# EAGLE design wykonawczy (EAGLE 6.4)
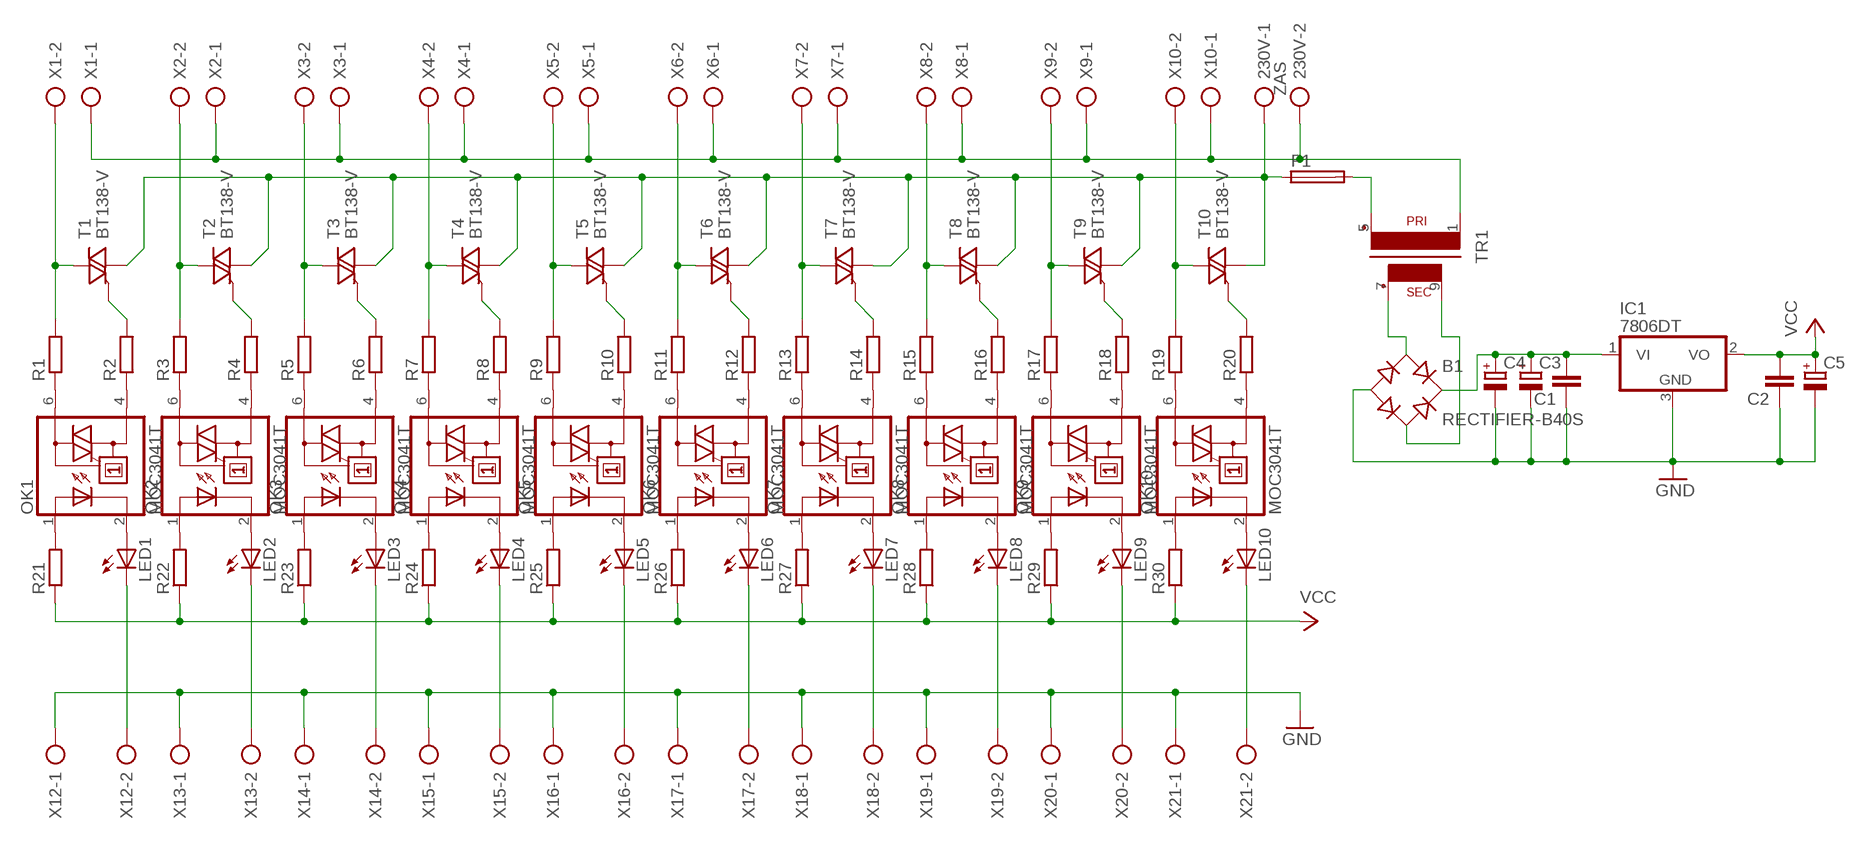
[diagram p0: schematic, sheet 1]

## Parts
230V  ZAS  AK500/2  [AK500/2]
B1  RECTIFIER-B40S  [B40S]
C1  C-EU025-025X050  [C025-025X050]
C2  C-EU025-025X050  [C025-025X050]
C3  CPOL-EUE2.5-6  [E2,5-6]
C4  CPOL-EUE2.5-6  [E2,5-6]
C5  CPOL-EUE2.5-6  [E2,5-6]
F1  19560  [19560]
IC1  7806DT  [TO252]
LED1  LED5MM  [LED5MM]
LED2  LED5MM  [LED5MM]
LED3  LED5MM  [LED5MM]
LED4  LED5MM  [LED5MM]
LED5  LED5MM  [LED5MM]
LED6  LED5MM  [LED5MM]
LED7  LED5MM  [LED5MM]
LED8  LED5MM  [LED5MM]
LED9  LED5MM  [LED5MM]
LED10  LED5MM  [LED5MM]
OK1  MOC3041T  [DIL06B]
OK2  MOC3041T  [DIL06B]
OK3  MOC3041T  [DIL06B]
OK4  MOC3041T  [DIL06B]
OK5  MOC3041T  [DIL06B]
OK6  MOC3041T  [DIL06B]
OK7  MOC3041T  [DIL06B]
OK8  MOC3041T  [DIL06B]
OK9  MOC3041T  [DIL06B]
OK10  MOC3041T  [DIL06B]
R1  R-EU_0204/7  [0204/7]
R2  R-EU_0204/7  [0204/7]
R3  R-EU_0204/7  [0204/7]
R4  R-EU_0204/7  [0204/7]
R5  R-EU_0204/7  [0204/7]
R6  R-EU_0204/7  [0204/7]
R7  R-EU_0204/7  [0204/7]
R8  R-EU_0204/7  [0204/7]
R9  R-EU_0204/7  [0204/7]
R10  R-EU_0204/7  [0204/7]
R11  R-EU_0204/7  [0204/7]
R12  R-EU_0204/7  [0204/7]
R13  R-EU_0204/7  [0204/7]
R14  R-EU_0204/7  [0204/7]
R15  R-EU_0204/7  [0204/7]
R16  R-EU_0204/7  [0204/7]
R17  R-EU_0204/7  [0204/7]
R18  R-EU_0204/7  [0204/7]
R19  R-EU_0204/7  [0204/7]
R20  R-EU_0204/7  [0204/7]
R21  R-EU_0204/7  [0204/7]
R22  R-EU_0204/7  [0204/7]
R23  R-EU_0204/7  [0204/7]
R24  R-EU_0204/7  [0204/7]
R25  R-EU_0204/7  [0204/7]
R26  R-EU_0204/7  [0204/7]
R27  R-EU_0204/7  [0204/7]
R28  R-EU_0204/7  [0204/7]
R29  R-EU_0204/7  [0204/7]
R30  R-EU_0204/7  [0204/7]
T1  BT138-V  [TO220BV]
T2  BT138-V  [TO220BV]
T3  BT138-V  [TO220BV]
T4  BT138-V  [TO220BV]
T5  BT138-V  [TO220BV]
T6  BT138-V  [TO220BV]
T7  BT138-V  [TO220BV]
T8  BT138-V  [TO220BV]
T9  BT138-V  [TO220BV]
T10  BT138-V  [TO220BV]
TR1  EI30-1  [EI30-1]
X1  AK500/2  [AK500/2]
X2  AK500/2  [AK500/2]
X3  AK500/2  [AK500/2]
X4  AK500/2  [AK500/2]
X5  AK500/2  [AK500/2]
X6  AK500/2  [AK500/2]
X7  AK500/2  [AK500/2]
X8  AK500/2  [AK500/2]
X9  AK500/2  [AK500/2]
X10  AK500/2  [AK500/2]
X12  AK500/2  [AK500/2]
X13  AK500/2  [AK500/2]
X14  AK500/2  [AK500/2]
X15  AK500/2  [AK500/2]
X16  AK500/2  [AK500/2]
X17  AK500/2  [AK500/2]
X18  AK500/2  [AK500/2]
X19  AK500/2  [AK500/2]
X20  AK500/2  [AK500/2]
X21  AK500/2  [AK500/2]

## Nets
GND: B1.- C1.1 C2.1 C3.- C4.- C5.- IC1.3(GND) X12.1 X13.1 X14.1 X15.1 X16.1 X17.1 X18.1 X19.1 X20.1 X21.1
N$1: R2.2 T1.G
N$2: OK1.4(A1) R2.1
N$3: OK2.4(A1) R4.1
N$4: R4.2 T2.G
N$5: OK3.4(A1) R6.1
N$6: OK4.4(A1) R8.1
N$7: OK5.4(A1) R10.1
N$8: OK6.4(A1) R12.1
N$9: OK7.4(A1) R14.1
N$10: OK8.4(A1) R16.1
N$11: OK9.4(A1) R18.1
N$12: OK10.4(A1) R20.1
N$13: R6.2 T3.G
N$14: R8.2 T4.G
N$15: R10.2 T5.G
N$16: R12.2 T6.G
N$17: R14.2 T7.G
N$18: R16.2 T8.G
N$19: R18.2 T9.G
N$20: R20.2 T10.G
N$21: OK1.6(A2) R1.1
N$22: OK2.6(A2) R3.1
N$23: OK3.6(A2) R5.1
N$24: OK4.6(A2) R7.1
N$25: OK5.6(A2) R9.1
N$26: OK6.6(A2) R11.1
N$27: OK7.6(A2) R13.1
N$28: OK8.6(A2) R15.1
N$29: OK9.6(A2) R17.1
N$30: OK10.6(A2) R19.1
N$31: R1.2 T1.T2(A2) X1.2
N$32: R3.2 T2.T2(A2) X2.2
N$33: R5.2 T3.T2(A2) X3.2
N$34: R7.2 T4.T2(A2) X4.2
N$35: R9.2 T5.T2(A2) X5.2
N$36: R11.2 T6.T2(A2) X6.2
N$37: R13.2 T7.T2(A2) X7.2
N$38: R15.2 T8.T2(A2) X8.2
N$39: R17.2 T9.T2(A2) X9.2
N$40: R19.2 T10.T2(A2) X10.2
N$41: 230V.1 F1.1 T1.T1(A1) T2.T1(A1) T3.T1(A1) T4.T1(A1) T5.T1(A1) T6.T1(A1) T7.T1(A1) T8.T1(A1) T9.T1(A1) T10.T1(A1)
N$42: F1.2 TR1.5(P2)
N$43: 230V.2 TR1.1 X1.1 X2.1 X3.1 X4.1 X5.1 X6.1 X7.1 X8.1 X9.1 X10.1
N$44: B1.AC1 TR1.7(S3)
N$45: B1.AC2 TR1.9(S4)
N$46: B1.+ C1.2 C3.+ C4.+ IC1.1(VI)
N$47: OK1.1(A) R21.2
N$48: OK2.1(A) R22.2
N$49: OK3.1(A) R23.2
N$50: LED1.A OK1.2(C)
N$51: LED2.A OK2.2(C)
N$52: LED3.A OK3.2(C)
N$53: LED4.A OK4.2(C)
N$54: LED5.A OK5.2(C)
N$55: LED6.A OK6.2(C)
N$56: LED7.A OK7.2(C)
N$57: LED8.A OK8.2(C)
N$58: LED9.A OK9.2(C)
N$59: LED10.A OK10.2(C)
N$60: LED1.K(C) X12.2
N$61: LED2.K(C) X13.2
N$62: LED3.K(C) X14.2
N$63: LED4.K(C) X15.2
N$64: LED5.K(C) X16.2
N$65: LED6.K(C) X17.2
N$66: LED7.K(C) X18.2
N$67: LED8.K(C) X19.2
N$68: LED9.K(C) X20.2
N$69: LED10.K(C) X21.2
N$70: OK4.1(A) R24.2
N$71: OK5.1(A) R25.2
N$72: OK6.1(A) R26.2
N$73: OK7.1(A) R27.2
N$74: OK8.1(A) R28.2
N$75: OK9.1(A) R29.2
N$76: OK10.1(A) R30.2
VCC: C2.2 C5.+ IC1.2(VO) R21.1 R22.1 R23.1 R24.1 R25.1 R26.1 R27.1 R28.1 R29.1 R30.1

## Library data of the parts
230V X1-X10 X12-X21 = con-ptr500:AK500/2: CONNECTOR; OC_FARNELL: unknown; OC_NEWARK: unknown
B1 = rectifier:RECTIFIER-: Rectifier
C1 C2 = rcl:C-EU: CAPACITOR, European symbol
C3-C5 = rcl:CPOL-EU: POLARIZED CAPACITOR, European symbol
F1 = fuse:19560: FUSE HOLDER TR5, Wickmann; MPN: 56000001009; OC_FARNELL: 1185363; OC_NEWARK: 15P8392
IC1 = linear:78*: Positive VOLTAGE REGULATOR Source: http://cache.national.com/ds/LM/LM78L05.pdf http://www.fairchildsemi.com/ds/LM/LM7805.pdf
LED1-LED10 = led:LED: LED OSRAM: - CHIPLED LG R971, LG N971, LY N971, LG Q971, LY Q971, LO R971, LY R971 LH N974, LH R974 LS Q976, LO Q976, LY Q976 LO Q996 - Hyper CHIPLED LW Q18S LB Q993, LB Q99A, LB R99A - SideLED LS A670, LO A670, LY A670, LG A670, LP A670 LB A673, LV A673, LT A673, LW A673 LH A674 LY A675 LS A676, LA A676, LO A676, LY A676, LW A676 LS A679, LY A679, LG A679 - Hyper Micro SIDELED® LS Y876, LA Y876, LO Y876, LY Y876 LT Y87S - SmartLED LW L88C, LW L88S LB L89C, LB L89S, LG L890 LS L89K, LO L89K, LY L89K LS L896, LA L896, LO L896, LY L896 - TOPLED LS T670, LO T670, LY T670, LG T670, LP T670 LSG T670, LSP T670, LSY T670, LOP T670, LYG T670 LG T671, LOG T671, LSG T671 LB T673, LV T673, LT T673, LW T673 LH T674 LS T676, LA T676, LO T676, LY T676, LB T676, LH T676, LSB T676, LW T676 LB T67C, LV T67C, LT T67C, LS T67K, LO T67K, LY T67K, LW E67C LS E67B, LA E67B, LO E67B, LY E67B, LB E67C, LV E67C, LT E67C LW T67C LS T679, LY T679, LG T679 LS T770, LO T770, LY T770, LG T770, LP T770 LB T773, LV T773, LT T773, LW T773 LH T774 LS E675, LA E675, LY E675, LS T675 LS T776, LA T776, LO T776, LY T776, LB T776 LHGB T686 LT T68C, LB T68C - Hyper Mini TOPLED® LB M676 - Mini TOPLED Santana® LG M470 LS M47K, LO M47K, LY M47K Source: http://www.osram.convergy.de LUXEON: - LUMILED® LXK2-PW12-R00, LXK2-PW12-S00, LXK2-PW14-U00, LXK2-PW14-V00 LXK2-PM12-R00, LXK2-PM12-S00, LXK2-PM14-U00 LXK2-PE12-Q00, LXK2-PE12-R00, LXK2-PE12-S00, LXK2-PE14-T00, LXK2-PE14-U00 LXK2-PB12-K00, LXK2-PB12-L00, LXK2-PB12-M00, LXK2-PB14-N00, LXK2-PB14-P00, LXK2-PB14-Q00 LXK2-PR12-L00, LXK2-PR12-M00, LXK2-PR14-Q00, LXK2-PR14-R00 LXK2-PD12-Q00, LXK2-PD12-R00, LXK2-PD12-S00 LXK2-PH12-R00, LXK2-PH12-S00 LXK2-PL12-P00, LXK2-PL12-Q00, LXK2-PL12-R00 Source: www.luxeon.com KINGBRIGHT: KA-3528ASYC Source: www.kingbright.com
OK1-OK10 = optocoupler:MOC30*: 6-Pin DIP Zero-Cross Optoisolators Triac Driver Output (250/400 Volt Peak) Source: http://www.fairchildsemi.com/ds/MO/MOC3043-M.pdf; OC_FARNELL: unknown; OC_NEWARK: unknown
R1-R30 = rcl:R-EU_: RESISTOR, European symbol
T1-T10 = triac:BT138: TRIAC Source: http://www.semiconductors.philips.com BT138_SERIES_2.pdf
TR1 = trafo:EI30-1: TRANSFORMER 1 primary winding, 1 secondary winding ERA

## Board
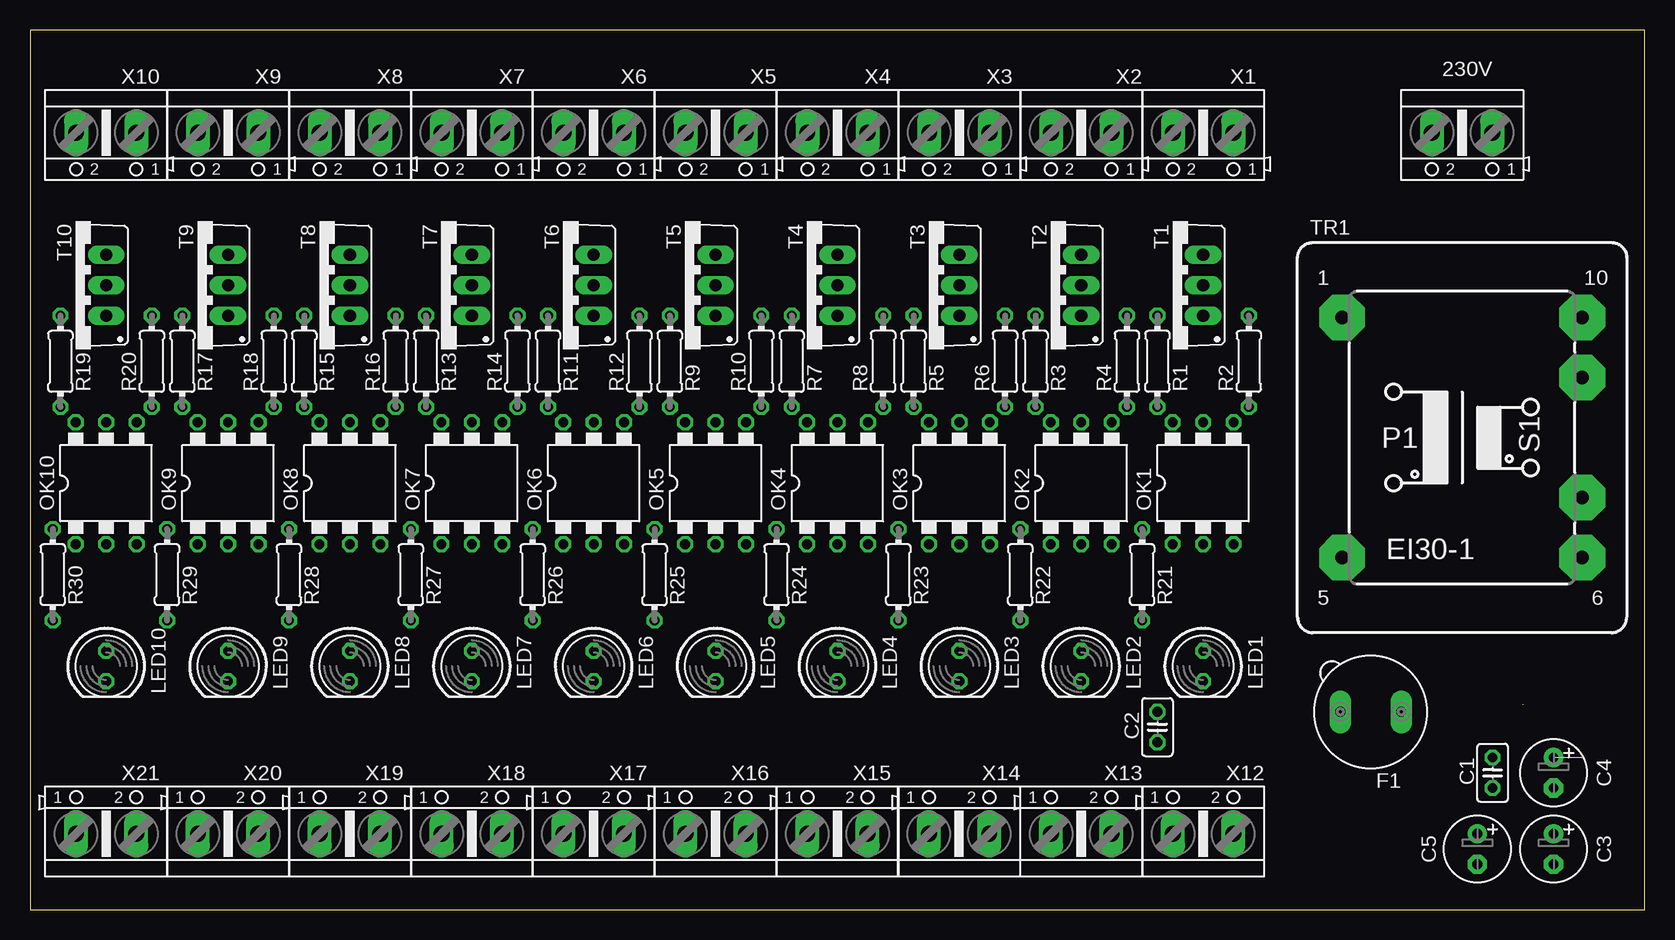
[diagram p1: board, top side]
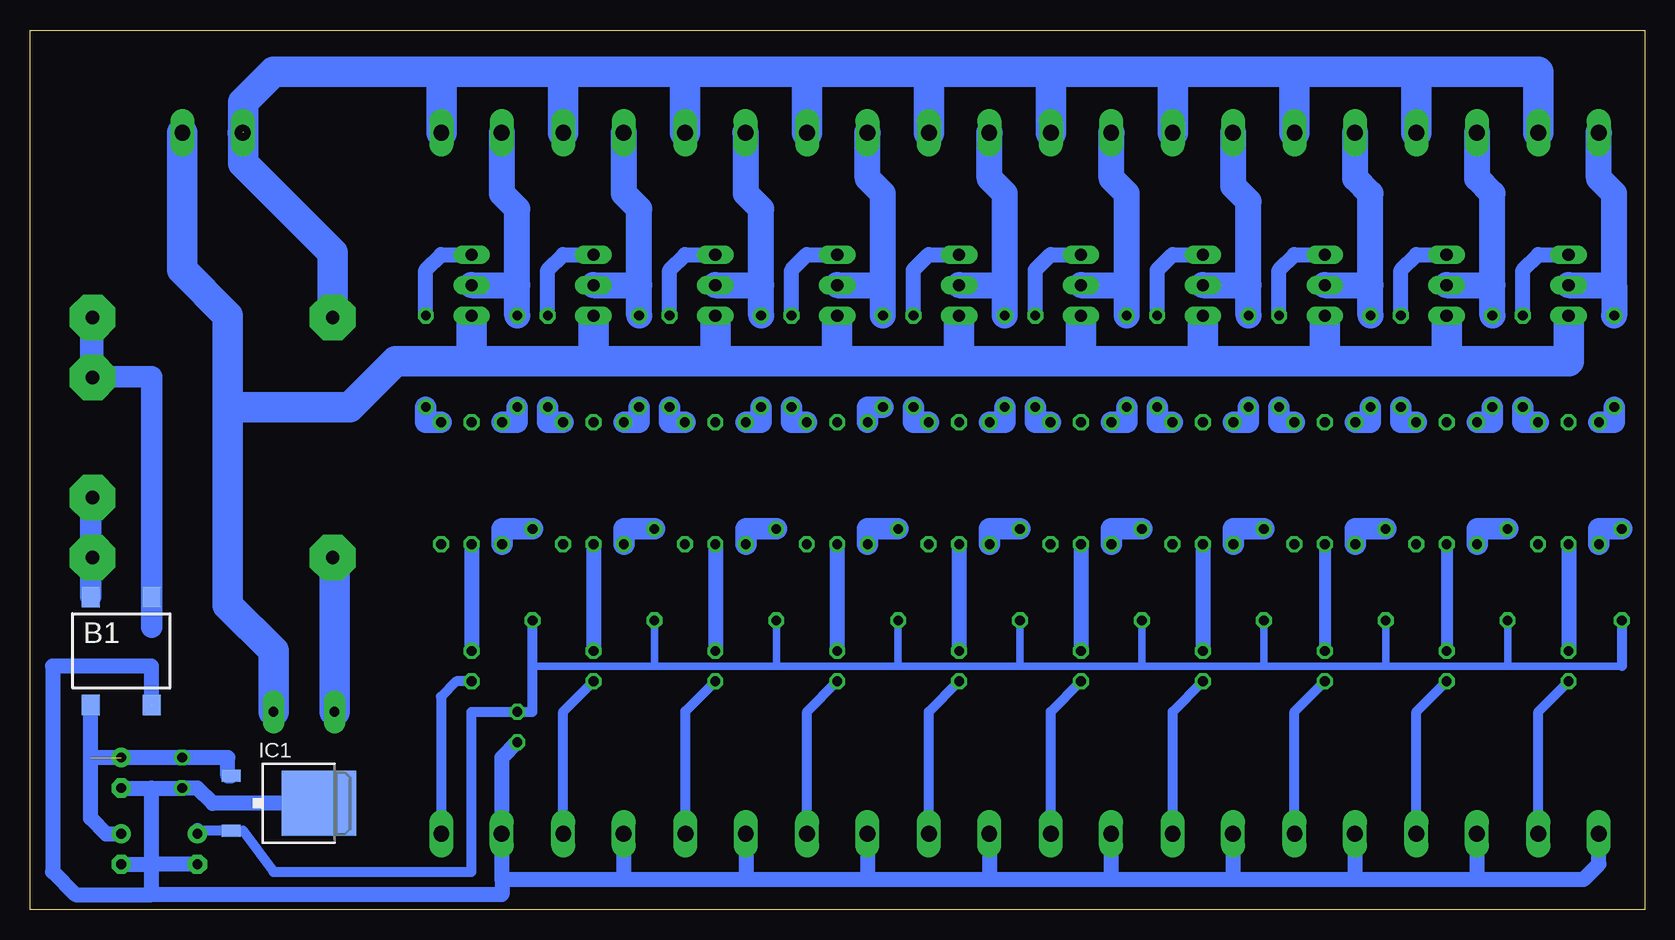
[diagram p2: board, bottom side, seen from below]

Size 134.6 x 73.33 mm. Coordinates in mm from the lower left corner, seen from the top.
Outline: 0,0 134.6,0 134.6,73.33 0,73.33 0,0
Copper layers (1*16): Top 0.035mm / dielectric 1.5mm / Bottom 0.035mm
Design rules "default": minimum track width 10mil, minimum drill 24mil, track to track 8mil, track to pad 8mil, pad to pad 8mil, via to via 8mil, smd to smd 8mil, copper to edge 40mil, drill to drill 8mil, minimum pad ring 10mil, minimum via ring 8mil, stop-mask expansion 4mil, vias tented up to drill 0mil, thermal gap 10mil

### Footprints (pad centres in the part's own frame; a part is rotated, then mirrored left to right if it is on the bottom)
AK500/2 = drill 1.321 long: 1 -2.515,0; 2 2.515,0
B40S = smd 1.5 x 1.7: + -2.55,-4.5; - 2.55,-4.5; AC1 -2.55,4.5; AC2 2.55,4.5
C025-025X050 = drill 0.813 octagon: 1 -1.27,0; 2 1.27,0
E2,5-6 = drill 0.813 pad 1.6: + -1.27,0 | drill 0.813 pad 1.6 octagon: - 1.27,0
19560 = drill 0.813 pad 1.778 long: 1 -2.54,0; 2 2.54,0
TO252 = smd 1 x 1.6: 1 -2.28,-4.8; 2 2.28,-4.8 | smd 5.4 x 6.2: 3 0,2.5
LED5MM = drill 0.813 octagon: A -1.27,0; K 1.27,0
DIL06B = drill 0.813 octagon: 1 -2.54,-5.08; 2 0,-5.08; 3 2.54,-5.08; 4 2.54,5.08; 5 0,5.08; 6 -2.54,5.08
0204/7 = drill 0.813 octagon: 1 -3.81,0; 2 3.81,0
TO220BV = drill 1.016 long: G 2.54,-2.54; T1 -2.54,-2.54; T2 0,-2.54
EI30-1 = drill 1.118 pad 3.81 octagon: 1 -10.008,10.008; 5 -10.008,-10.008; 6 10.008,-10.008; 7 10.008,-5.004; 9 10.008,5.004; 10 10.008,10.008

### Placement (x,y rotation side)
230V  119.38,64.77 180 top
B1  127,21.59 0 bottom
C1  121.92,11.43 90 top
C2  93.98,15.24 90 top
C3  127,5.08 270 top
C4  127,11.43 270 top
C5  120.65,5.08 270 top
F1  111.76,16.51 180 top
IC1  113.03,8.89 270 bottom
LED1  97.79,20.32 270 top
LED2  87.63,20.32 270 top
LED3  77.47,20.32 270 top
LED4  67.31,20.32 270 top
LED5  57.15,20.32 270 top
LED6  46.99,20.32 270 top
LED7  36.83,20.32 270 top
LED8  26.67,20.32 270 top
LED9  16.51,20.32 270 top
LED10  6.35,20.32 270 top
OK1  97.79,35.56 0 top
OK2  87.63,35.56 0 top
OK3  77.47,35.56 0 top
OK4  67.31,35.56 0 top
OK5  57.15,35.56 0 top
OK6  46.99,35.56 0 top
OK7  36.83,35.56 0 top
OK8  26.67,35.56 0 top
OK9  16.51,35.56 0 top
OK10  6.35,35.56 0 top
R1  93.98,45.72 90 top
R2  101.6,45.72 90 top
R3  83.82,45.72 90 top
R4  91.44,45.72 90 top
R5  73.66,45.72 90 top
R6  81.28,45.72 90 top
R7  63.5,45.72 90 top
R8  71.12,45.72 90 top
R9  53.34,45.72 90 top
R10  60.96,45.72 90 top
R11  43.18,45.72 90 top
R12  50.8,45.72 90 top
R13  33.02,45.72 90 top
R14  40.64,45.72 90 top
R15  22.86,45.72 90 top
R16  30.48,45.72 90 top
R17  12.7,45.72 90 top
R18  20.32,45.72 90 top
R19  2.54,45.72 90 top
R20  10.16,45.72 90 top
R21  92.71,27.94 90 top
R22  82.55,27.94 90 top
R23  72.39,27.94 90 top
R24  62.23,27.94 90 top
R25  52.07,27.94 90 top
R26  41.91,27.94 90 top
R27  31.75,27.94 90 top
R28  21.59,27.94 90 top
R29  11.43,27.94 90 top
R30  1.91,27.94 90 top
T1  95.25,52.07 90 top
T2  85.09,52.07 90 top
T3  74.93,52.07 90 top
T4  64.77,52.07 90 top
T5  54.61,52.07 90 top
T6  44.45,52.07 90 top
T7  34.29,52.07 90 top
T8  24.13,52.07 90 top
T9  13.97,52.07 90 top
T10  3.81,52.07 90 top
TR1  119.38,39.37 0 top
X1  97.79,64.77 180 top
X2  87.63,64.77 180 top
X3  77.47,64.77 180 top
X4  67.31,64.77 180 top
X5  57.15,64.77 180 top
X6  46.99,64.77 180 top
X7  36.83,64.77 180 top
X8  26.67,64.77 180 top
X9  16.51,64.77 180 top
X10  6.35,64.77 180 top
X12  97.79,6.35 0 top
X13  87.63,6.35 0 top
X14  77.44,6.35 0 top
X15  67.31,6.35 0 top
X16  57.15,6.35 0 top
X17  46.99,6.35 0 top
X18  36.83,6.35 0 top
X19  26.67,6.35 0 top
X20  16.51,6.35 0 top
X21  6.35,6.35 0 top

### Tracks (layer width: path | path; a pad name or v marks a point on that pad's centre or on a via)
GND  (1 unrouted)
  Bottom 0.813: X12.1 95.28,2.56 95.25,2.54
  Bottom 1.27: C5.- 124.46,3.81 | C4.- 124.46,10.16 | 124.46,10.16 C1.1 120.65,10.16 119.38,8.89 IC1.3 | 95.25,2.54 95.25,1.27 124.46,1.27 | B1.- 124.46,20.32 132.72,20.32 132.72,3.17 130.81,1.27 124.46,1.27 | 124.46,1.27 124.46,3.81 | 95.25,2.54 95.25,12.7 C2.1 | 95.25,2.54 85.09,2.54 | 85.09,2.54 74.93,2.54 | 74.93,2.54 64.77,2.54 | 64.77,2.54 54.61,2.54 | 54.61,2.54 44.45,2.54 | 44.45,2.54 34.29,2.54 | 34.29,2.54 24.13,2.54 | 24.13,2.54 13.97,2.54 | 13.97,2.54 5.08,2.54 3.81,3.81 3.81,6.32 X21.1 | X20.1 14,2.56 13.97,2.54 | X19.1 24.15,2.56 24.13,2.54 | X18.1 34.31,2.56 34.29,2.54 | X17.1 44.48,2.56 44.45,2.54 | X16.1 54.64,2.56 54.61,2.54 | X15.1 64.8,2.56 64.77,2.54 | X14.1 74.93,2.54 | X13.1 85.12,2.56 85.09,2.54 | C3.- 124.46,3.81 | 124.46,3.81 124.46,10.16
N$1
  Bottom 1.27: R2.2 101.6,53.34 100.33,54.61 T1.G
N$2
  Bottom 1.778: OK1.4 101.6,40.64 R2.1
N$3
  Bottom 1.778: OK2.4 91.44,40.64 R4.1
N$4
  Bottom 1.27: R4.2 91.44,53.34 90.17,54.61 T2.G
N$5
  Bottom 1.778: R6.1 81.28,40.64 OK3.4
N$6
  Bottom 1.778: R8.1 71.12,40.64 OK4.4
N$7
  Bottom 1.778: R10.1 60.96,40.64 OK5.4
N$8
  Bottom 1.778: R12.1 50.8,40.64 OK6.4
N$9
  Bottom 1.778: OK7.4 40.64,40.64 R14.1
N$10
  Bottom 1.778: OK8.4 30.48,40.64 R16.1
N$11
  Bottom 1.778: OK9.4 20.32,40.64 R18.1
N$12
  Bottom 1.778: OK10.4 10.16,40.64 R20.1
N$13
  Bottom 1.27: R6.2 81.28,53.34 80.01,54.61 T3.G
N$14
  Bottom 1.27: R8.2 71.12,53.34 69.85,54.61 T4.G
N$15
  Bottom 1.27: R10.2 60.96,53.34 59.69,54.61 T5.G
N$16
  Bottom 1.27: R12.2 50.8,53.34 49.53,54.61 T6.G
N$17
  Bottom 1.27: R14.2 40.64,53.34 39.37,54.61 T7.G
N$18
  Bottom 1.27: R16.2 30.48,53.34 29.21,54.61 T8.G
N$19
  Bottom 1.27: R18.2 20.32,53.34 19.05,54.61 T9.G
N$20
  Bottom 1.27: R20.2 10.16,53.34 8.89,54.61 T10.G
N$21
  Bottom 1.778: R1.1 93.98,40.64 OK1.6
N$22
  Bottom 1.778: R3.1 83.82,40.64 OK2.6
N$23
  Bottom 1.778: R5.1 73.66,40.64 OK3.6
N$24
  Bottom 1.778: R7.1 64.77,41.91 OK4.6
N$25
  Bottom 1.778: R9.1 53.34,40.64 OK5.6
N$26
  Bottom 1.778: R11.1 43.18,40.64 OK6.6
N$27
  Bottom 1.778: R13.1 33.02,40.64 OK7.6
N$28
  Bottom 1.778: OK8.6 22.86,40.64 R15.1
N$29
  Bottom 1.778: R17.1 12.7,40.64 OK9.6
N$30
  Bottom 1.778: OK10.6 2.54,40.64 R19.1
N$31
  Bottom 2.184: R1.2 93.98,52.07 | 93.98,52.07 93.98,58.42 95.25,59.69 95.25,64.75 X1.2 | T1.T2 93.98,52.07
N$32
  Bottom 2.184: R3.2 83.82,52.07 | 83.82,52.07 83.82,58.42 85.09,59.69 85.09,64.75 X2.2 | T2.T2 83.82,52.07
N$33
  Bottom 2.184: R5.2 73.66,52.07 | 73.66,52.07 73.66,58.42 74.93,59.69 74.93,64.75 X3.2 | T3.T2 73.66,52.07
N$34
  Bottom 2.184: R7.2 63.5,52.07 | 63.5,52.07 63.5,59.69 64.77,60.96 64.77,64.75 X4.2 | T4.T2 63.5,52.07
N$35
  Bottom 2.184: R9.2 53.34,52.07 | 53.34,52.07 53.34,59.69 54.61,60.96 54.61,64.75 X5.2 | T5.T2 53.34,52.07
N$36
  Bottom 2.184: R11.2 43.18,52.07 | 43.18,52.07 43.18,59.69 44.45,60.96 44.45,64.75 X6.2 | T6.T2 43.18,52.07
N$37
  Bottom 2.184: R13.2 33.02,52.07 | 33.02,52.07 33.02,59.06 34.29,60.33 34.29,64.75 X7.2 | T7.T2 33.02,52.07
N$38
  Bottom 2.184: R15.2 22.86,52.07 | 22.86,52.07 22.86,59.69 24.13,60.96 24.13,64.75 X8.2 | T8.T2 22.86,52.07
N$39
  Bottom 2.184: R17.2 12.7,52.07 | 12.7,52.07 12.7,59.69 13.97,60.96 13.97,64.75 X9.2 | T9.T2 12.7,52.07
N$40
  Bottom 2.184: T10.T2 2.54,52.07 | 2.54,52.07 R19.2 | 2.54,52.07 2.54,59.69 3.81,60.96 3.81,64.75 X10.2
N$41
  Bottom 0.61: T1.T1 97.79,48.89 | T9.T1 16.51,48.89
  Bottom 0.813: T10.T1 6.35,48.89 | T8.T1 26.67,48.89 | T7.T1 36.83,48.89 | 46.99,48.26 T6.T1 | T3.T1 77.47,48.89 | T4.T1 67.31,48.89 | T5.T1 57.15,48.89 | T2.T1 87.63,48.89
  Bottom 2.54: 6.35,48.89 6.35,45.72 16.51,45.72 | 16.51,48.89 16.51,45.72 | 16.51,45.72 26.67,45.72 | 26.67,45.72 36.83,45.72 | 36.83,45.72 46.99,45.72 | 46.99,45.72 57.15,45.72 | 57.15,45.72 67.31,45.72 | 67.31,45.72 77.47,45.72 | 77.47,45.72 87.63,45.72 | 87.63,45.72 97.79,45.72 | 118.11,41.91 107.95,41.91 104.14,45.72 97.79,45.72 | 97.79,45.72 97.79,48.89 | F1.1 114.3,21.59 118.11,25.4 118.11,41.91 | 118.11,41.91 118.11,49.53 121.92,53.34 121.9,54.64 230V.1 | 87.63,45.72 87.63,48.89 | 77.47,45.72 77.47,48.89 | 67.31,45.72 67.31,48.89 | 26.67,45.72 26.67,48.89 | 36.83,45.72 36.83,48.89 | 46.99,45.72 46.99,48.26 46.99,48.89 | 57.15,45.72 57.15,48.89
N$42
  Bottom 2.54: TR1.5 109.22,29.36 F1.2
N$43  (1 unrouted)
  Bottom 0.813: 29.18,69.83 29.21,69.85 | 19.03,69.83 10.18,69.83 10.16,69.85
  Bottom 2.54: X10.1 8.86,69.83 8.89,69.85 10.16,69.85 29.21,69.85 39.37,69.85 | 39.37,69.85 49.53,69.85 | 49.53,69.85 59.69,69.85 | 59.69,69.85 69.85,69.85 | 69.85,69.85 80.01,69.85 | 80.01,69.85 90.17,69.85 | 90.17,69.85 100.33,69.85 | 100.33,69.85 114.3,69.85 116.84,67.31 116.84,64.8 | TR1.1 109.37,54.76 116.84,62.23 116.84,64.75 230V.2 | X9.1 19.03,69.83 | X8.1 29.18,69.83 | X1.1 100.31,69.83 100.33,69.85 | X2.1 90.15,69.83 90.17,69.85 | X3.1 79.98,69.83 80.01,69.85 | X4.1 69.83,69.83 69.85,69.85 | X5.1 59.67,69.83 59.69,69.85 | X6.1 49.51,69.83 49.53,69.85 | X7.1 39.34,69.83 39.37,69.85
N$44
  Bottom 1.778: TR1.7 129.54,34.37 129.54,29.21 129.55,29.21 B1.AC1
N$45
  Bottom 1.778: B1.AC2 124.46,23.55 124.46,44.45 129.54,44.45 129.54,49.53 129.39,49.53 TR1.9
N$46  (1 unrouted)
  Bottom 1.27: IC1.1 118.11,11.17 118.11,12.7 C1.2 129.55,12.7 | 129.55,12.7 129.55,7.63 128.27,6.35 C3.+ | 129.55,12.7 B1.+
N$47
  Bottom 1.778: R21.2 95.25,31.75 OK1.1
N$48
  Bottom 1.778: R22.2 85.09,31.75 OK2.1
N$49
  Bottom 1.778: R23.2 74.93,31.75 OK3.1
N$50
  Bottom 1.27: OK1.2 LED1.A
N$51
  Bottom 1.27: OK2.2 LED2.A
N$52
  Bottom 1.27: OK3.2 LED3.A
N$53
  Bottom 1.27: OK4.2 LED4.A
N$54
  Bottom 1.27: OK5.2 LED5.A
N$55
  Bottom 1.27: OK6.2 LED6.A
N$56
  Bottom 1.27: OK7.2 LED7.A
N$57
  Bottom 1.016: OK8.2 LED8.A
N$58
  Bottom 1.016: OK9.2 LED9.A
N$59
  Bottom 1.27: OK10.2 LED10.A
N$60
  Bottom 0.813: LED1.K 99.06,19.05 100.33,17.78 100.33,6.37 X12.2
N$61
  Bottom 0.813: X13.2 90.15,16.54 LED2.K
N$62
  Bottom 0.813: X14.2 79.96,16.56 LED3.K
N$63
  Bottom 0.813: X15.2 69.83,16.54 LED4.K
N$64
  Bottom 0.813: X16.2 59.67,16.54 LED5.K
N$65
  Bottom 0.813: X17.2 49.51,16.54 LED6.K
N$66
  Bottom 0.813: X18.2 39.34,16.54 LED7.K
N$67
  Bottom 0.813: X19.2 29.18,16.54 LED8.K
N$68
  Bottom 0.813: X20.2 19.03,16.54 LED9.K
N$69
  Bottom 0.813: X21.2 8.86,16.54 LED10.K
N$70
  Bottom 1.778: R24.2 64.77,31.75 OK4.1
N$71
  Bottom 1.778: R25.2 54.61,31.75 OK5.1
N$72
  Bottom 1.778: R26.2 44.45,31.75 OK6.1
N$73
  Bottom 1.778: R27.2 34.29,31.75 OK7.1
N$74
  Bottom 1.778: R28.2 24.13,31.75 OK8.1
N$75
  Bottom 1.778: R29.2 13.97,31.75 OK9.1
N$76
  Bottom 1.778: R30.2 3.81,31.75 OK10.1
VCC
  Bottom 0.61: 1.91,20.32 11.43,20.32 | 11.43,20.32 21.59,20.32 | 21.59,20.32 31.75,20.32 | 31.75,20.32 41.91,20.32 | 41.91,20.32 52.07,20.32 | 52.07,20.32 62.23,20.32 | 62.23,20.32 72.39,20.32 | 72.39,20.32 82.55,20.32 | 82.55,20.32 92.71,20.32 R21.1 | R22.1 82.55,20.32 | R23.1 72.39,20.32 | R24.1 62.23,20.32 | R25.1 52.07,20.32 | R26.1 41.91,20.32 | R27.1 31.75,20.32 | R28.1 21.59,20.32 | R29.1 11.43,20.32
  Bottom 0.813: R30.1 1.91,20.32 | R21.1 92.71,16.51 C2.2 97.79,16.51 97.79,3.17 114.3,3.17 116.84,6.61 IC1.2 120.65,6.61
  Bottom 1.27: 120.65,6.61 C5.+